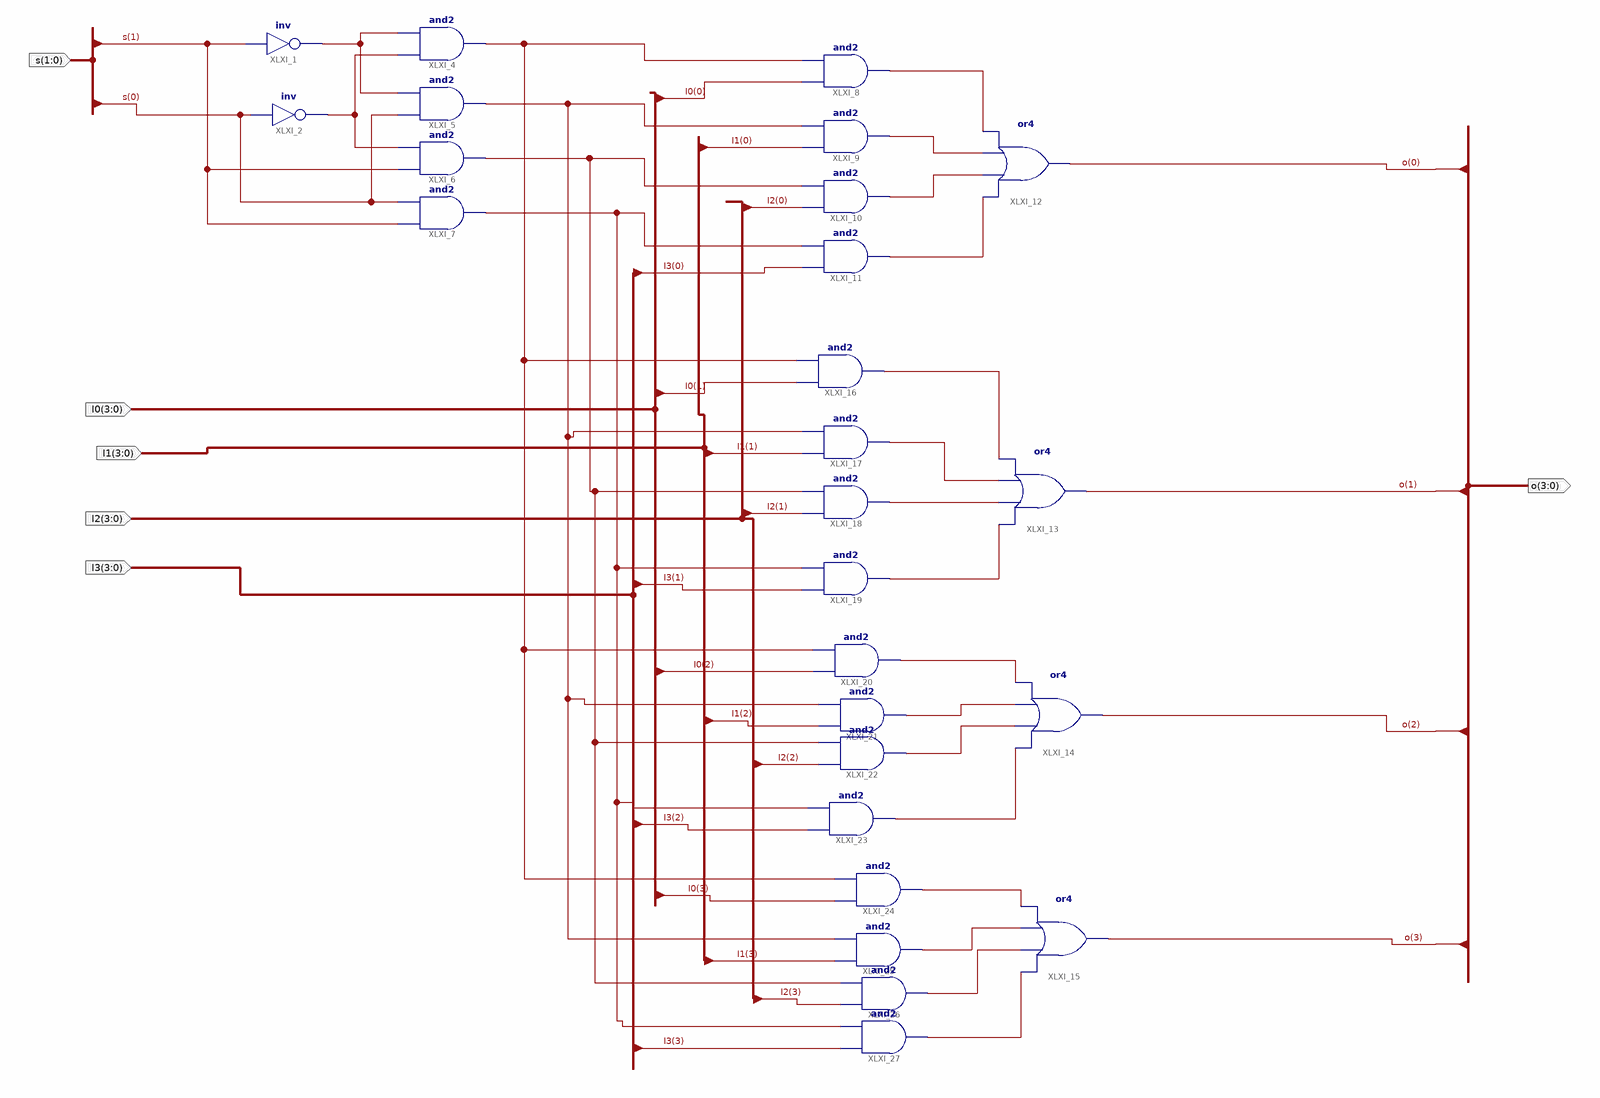
[diagram p0: schematic sheet 1]
// Xilinx ISE schematic Mux4to1b4.sch (kintex7) as structural Verilog: 26 symbols, 6 ports
module Mux4to1b4 (
  input  [1:0] s,
  input  [3:0] I0,
  input  [3:0] I1,
  input  [3:0] I2,
  input  [3:0] I3,
  output [3:0] o
);

  wire XLXN_1, XLXN_3, XLXN_14, XLXN_15, XLXN_16, XLXN_17, XLXN_19, XLXN_23, XLXN_24, XLXN_25, XLXN_26,
       XLXN_28, XLXN_31, XLXN_32, XLXN_33, XLXN_34, XLXN_35, XLXN_38, XLXN_40, XLXN_41, XLXN_42, XLXN_43;

  not XLXI_1 (XLXN_1, s[1]);
  not XLXI_2 (XLXN_3, s[0]);
  and XLXI_4 (XLXN_28, XLXN_3, XLXN_1);
  and XLXI_5 (XLXN_19, s[0], XLXN_1);
  and XLXI_6 (XLXN_38, s[1], XLXN_3);
  and XLXI_7 (XLXN_31, s[1], s[0]);
  and XLXI_8 (XLXN_14, I0[0], XLXN_28);
  and XLXI_9 (XLXN_15, I1[0], XLXN_19);
  and XLXI_10 (XLXN_16, I2[0], XLXN_38);
  and XLXI_11 (XLXN_17, I3[0], XLXN_31);
  or XLXI_12 (o[0], XLXN_17, XLXN_16, XLXN_15, XLXN_14);
  or XLXI_13 (o[1], XLXN_26, XLXN_25, XLXN_24, XLXN_23);
  or XLXI_14 (o[2], XLXN_35, XLXN_34, XLXN_33, XLXN_32);
  or XLXI_15 (o[3], XLXN_43, XLXN_42, XLXN_41, XLXN_40);
  and XLXI_16 (XLXN_23, I0[1], XLXN_28);
  and XLXI_17 (XLXN_24, I1[1], XLXN_19);
  and XLXI_18 (XLXN_25, I2[1], XLXN_38);
  and XLXI_19 (XLXN_26, I3[1], XLXN_31);
  and XLXI_20 (XLXN_32, I0[2], XLXN_28);
  and XLXI_21 (XLXN_33, I1[2], XLXN_19);
  and XLXI_22 (XLXN_34, I2[2], XLXN_38);
  and XLXI_23 (XLXN_35, I3[2], XLXN_31);
  and XLXI_24 (XLXN_40, I0[3], XLXN_28);
  and XLXI_25 (XLXN_41, I1[3], XLXN_19);
  and XLXI_26 (XLXN_42, I2[3], XLXN_38);
  and XLXI_27 (XLXN_43, I3[3], XLXN_31);
endmodule
